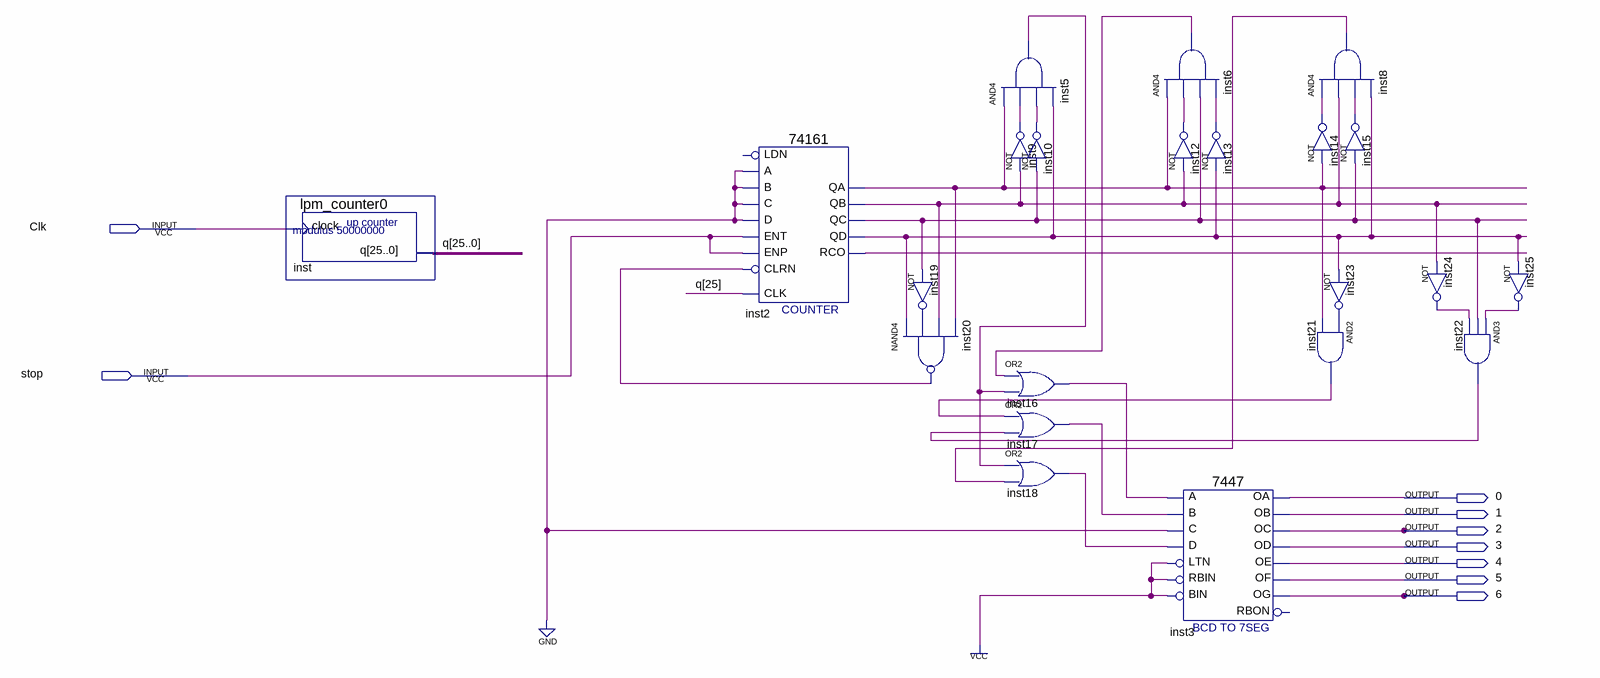
[diagram p0: schematic sheet]
// Quartus schematic 3_2.bdf as structural Verilog: 22 symbols, 9 pins
module \3_2  (
  input  Clk,
  input  stop,
  output \0 ,
  output \1 ,
  output \2 ,
  output \3 ,
  output \4 ,
  output \5 ,
  output \6 
);

  wire inst2_qa, inst2_qb, inst2_qc, inst2_qd, inst2_rco, inst5_out, inst6_out, inst8_out, inst9_out,
       inst10_out, inst12_out, inst13_out, inst14_out, inst15_out, inst16_out, inst17_out, inst18_out,
       inst19_out, inst20_out, inst21_out, inst22_out, inst23_out, inst24_out, inst25_out;
  wire [25:0] q;

  lpm_counter0 inst (.clock(Clk), .q(q));
  \74161  inst2 (
    .CLRN(inst20_out), .CLK(q[25]), .ENP(stop), .A(1'b0), .D(1'b0), .ENT(stop), .B(1'b0), .C(1'b0),
    .QD(inst2_qd), .QC(inst2_qc), .QB(inst2_qb), .QA(inst2_qa), .RCO(inst2_rco));  // open: LDN
  not inst19 (inst19_out, inst2_qc);
  nand inst20 (inst20_out, inst2_qd, inst19_out, inst2_qb, inst2_qa);
  and inst5 (inst5_out, inst2_qa, inst9_out, inst10_out, inst2_qd);
  not inst9 (inst9_out, inst2_qb);
  or inst16 (inst16_out, inst6_out, inst5_out);
  or inst17 (inst17_out, inst21_out, inst22_out);
  or inst18 (inst18_out, inst5_out, inst8_out);
  not inst10 (inst10_out, inst2_qc);
  and inst6 (inst6_out, inst2_qa, inst12_out, inst2_qc, inst13_out);
  not inst12 (inst12_out, inst2_qb);
  not inst13 (inst13_out, inst2_qd);
  \7447  inst3 (
    .LTN(1'b1), .B(inst17_out), .C(1'b0), .D(inst18_out), .RBIN(1'b1), .BIN(1'b1), .A(inst16_out), .OB(\1 ),
    .OC(\2 ), .OE(\4 ), .OD(\3 ), .OF(\5 ), .OG(\6 ), .OA(\0 ));  // open: RBON
  and inst8 (inst8_out, inst14_out, inst2_qb, inst15_out, inst2_qd);
  not inst14 (inst14_out, inst2_qa);
  not inst23 (inst23_out, inst2_qd);
  and inst21 (inst21_out, inst23_out, inst2_qa);
  not inst15 (inst15_out, inst2_qc);
  not inst24 (inst24_out, inst2_qb);
  and inst22 (inst22_out, inst25_out, inst2_qc, inst24_out);
  not inst25 (inst25_out, inst2_qd);
endmodule
